# Altium schematic sheet GNSSModule.SchDoc
size A4; SheetNumber: 12; SheetTotal: 22
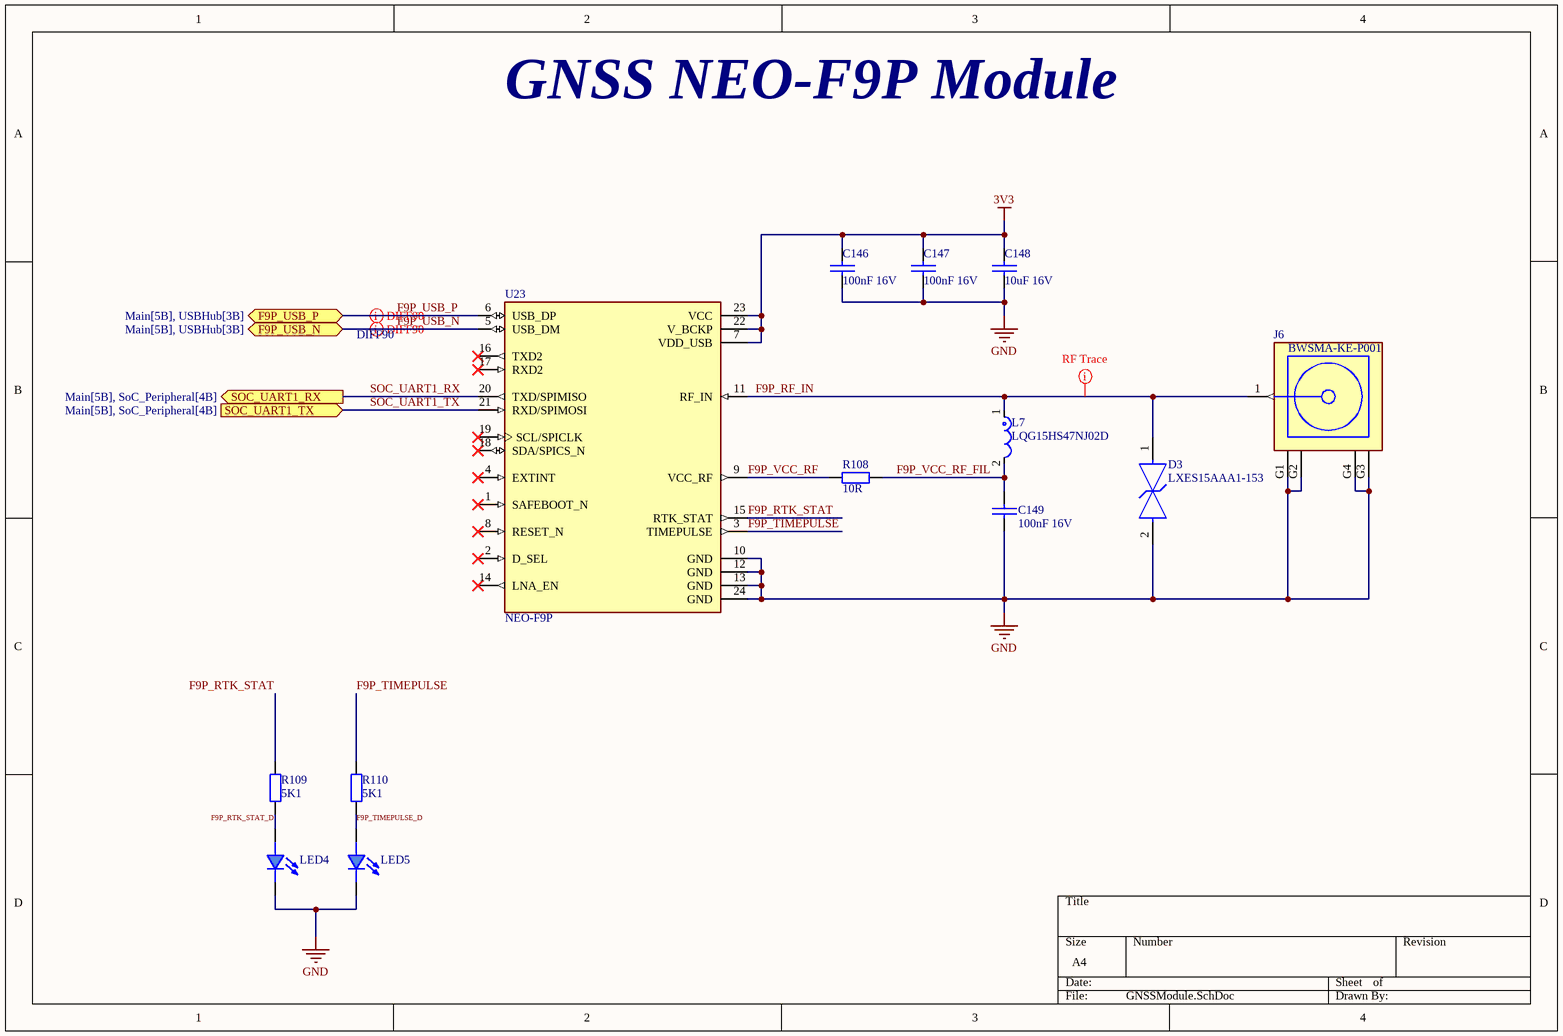
[diagram p0: GNSSModule.SchDoc]

## Parts
C146  100nF 16V  [C_0402]
C147  100nF 16V  [C_0402]
C148  10uF 16V  [C_0603]
C149  100nF 16V  [C_0402]
D3  LXES15AAA1-153  [FP-LXES15-MFG]
J6  BWSMA-KE-P001  [BATWIRELESS_BWSMA-KE-P001]
L7  LQG15HS47NJ02D  [FP-LQG15HH_02-IPC_B]
LED4  LED_0603_BLUE  [LED_0603]  (value not drawn)
LED5  LED_0603_BLUE  [LED_0603]  (value not drawn)
R108  10R  [R_0402]
R109  5K1  [R_0603]
R110  5K1  [R_0603]
U23  NEO-F9P  [NEO-F9P]

## Ports
F9P_USB_N (bidir, see Main[5B], USBHub[3B]), F9P_USB_P (bidir, see Main[5B], USBHub[3B]), SOC_UART1_RX (out, see Main[5B], SoC_Peripheral[4B]), SOC_UART1_TX (in, see Main[5B], SoC_Peripheral[4B])

## Nets
3V3: C146.1 C147.1 C148.1 U23.7(VDD_USB) U23.22(V_BCKP) U23.23(VCC)
GND: C146.2 C147.2 C148.2 C149.2 D3.2 J6.G1(GND) J6.G2(GND) J6.G3(GND) J6.G4(GND) LED4.2(C) LED5.2(C) U23.10(GND) U23.12(GND) U23.13(GND) U23.24(GND)
F9P_RF_IN: D3.1 J6.1(SIG) L7.1 U23.11(RF_IN)
F9P_RTK_STAT: R109.1 U23.15(RTK_STAT)
F9P_RTK_STAT_D: LED4.1(A) R109.2
F9P_TIMEPULSE: R110.1 U23.3(TIMEPULSE)
F9P_TIMEPULSE_D: LED5.1(A) R110.2
F9P_USB_N: U23.5(USB_DM) ; port F9P_USB_N
F9P_USB_P: U23.6(USB_DP) ; port F9P_USB_P
F9P_VCC_RF: R108.2 U23.9(VCC_RF)
F9P_VCC_RF_FIL: C149.1 L7.2 R108.1
SOC_UART1_RX: U23.20(TXD/SPIMISO) ; port SOC_UART1_RX
SOC_UART1_TX: U23.21(RXD/SPIMOSI) ; port SOC_UART1_TX

Not connected (* = marked no-connect by the designer): U23 1(SAFEBOOT_N)* 2(D_SEL)* 4(EXTINT)* 8(RESET_N)* 14(LNA_EN)* 16(TXD2)* 17(RXD2)* 18(SDA/SPICS_N)* 19(SCL/SPICLK)*

## Layout directives
differential pair; differential pair class DIFF90: F9P_USB_N, F9P_USB_P
net class RF_TRACE: F9P_RF_IN

## Notes on the sheet
- GNSS NEO-F9P Module

## Library data of the parts
C146 C147 C149 = C_0402: Capacitor 0402 SMD
C148 = C_0603: Capacitor 0603 SMD
D3 = CMP-06195-000025-1: TVS DIODE 4V 1005; Power Line Protection: No; Number of Bidirectional Channels: 1; Resistor Type: Zener; Case/Package: 0402; Max Operating Temperature: 85°C; Case Code (Metric): 1005; Packaging: Tape and Reel; Min Operating Temperature: -40°C; Mount: Surface Mount; Reverse Standoff Voltage: 4V; Case Code (Imperial): 0402
J6 = BWSMA-KE-P001: 1 Inner Hole SMA Board-End Staggered pins 50Ω 5.2mm SMD Coaxial Connectors (RF) ROHS; Manufacturer: BAT WIRELESS; Manufacturer Part Number: BWSMA-KE-P001; Datasheet Link: https://www.lcsc.com/datasheet/lcsc_datasheet_2410121647_BAT-WIRELESS-BWSMA-KE-P001_C496550.pdf
L7 = CMP-06042-015783-1: Multilayer type RF Inductor 47nH ±5% 0.72Ω 300mA 0402; Core Material: Air; DC Resistance (DCR): 720mR; DC Current: 200mA; Shielding: Unshielded; Self Resonant Frequency: 1GHz; Q Factor: 8; Test Frequency: 100MHz; Tolerance: 5%; Packaging: Tape and Reel; Case Code (Imperial): 0402; Max Operating Temperature: 125°C; Military Standard: Not; Length: 1mm; Radiation Hardening: No; Height: 0.5mm; Min Operating Temperature: -55°C; Width: 0.02inch; Inductance: 47nH; Lead Free: Lead Free; Termination: SMD/SMT; Height - Seated (Max): 0.022inch; Rated Current-Max: 200mA; Case/Package: 0402; Max DC Current: 200mA; Series: LQG15HS; Case Code (Metric): 1005; Mount: Surface Mount; Current Rating: 200mA; Depth: 0.55mm; Package Quantity: 1
R108 = R_0402: Resistor 0402 SMD
R109 R110 = R_0603: Resistor 0603 SMD
U23 = NEO-F9P: RF Receiver BeiDou, Galileo, GLONASS, GNSS, GPS -167dBm 921.6kbps; Manufacturer: u-blox; Manufacturer Part Number: NEO-F9P-15B; Datasheet Link: https://content.u-blox.com/sites/default/files/documents/NEO-F9P-15B_DataSheet_UBX-22021920.pdf